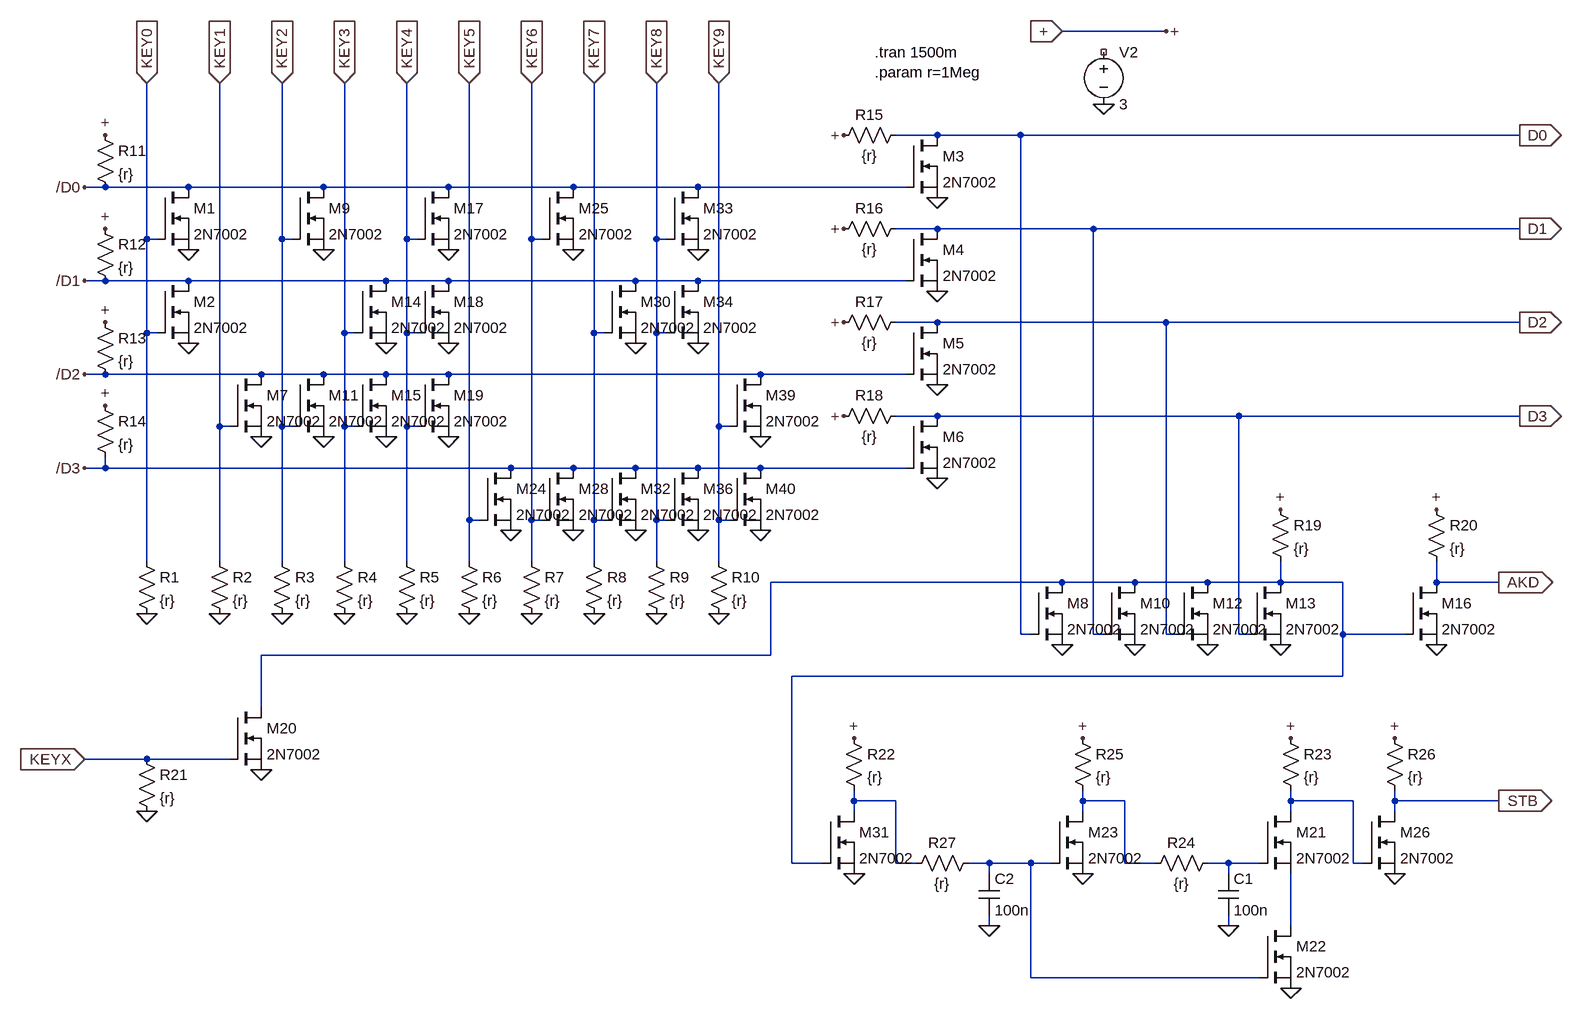
[diagram p0: schematic Keyboard.asc]
Keyboard.asc, the LTspice schematic file:
Version 4
SHEET 1 2060 1584
WIRE 1248 -80 1088 -80
WIRE 896 80 832 80
WIRE 1024 80 896 80
WIRE 1792 80 1024 80
WIRE -384 160 -416 160
WIRE -256 160 -384 160
WIRE -48 160 -256 160
WIRE 144 160 -48 160
WIRE 336 160 144 160
WIRE 528 160 336 160
WIRE 848 160 528 160
WIRE 896 224 832 224
WIRE 1136 224 896 224
WIRE 1792 224 1136 224
WIRE -320 240 -320 0
WIRE -304 240 -320 240
WIRE -112 240 -112 0
WIRE -96 240 -112 240
WIRE 80 240 80 0
WIRE 96 240 80 240
WIRE 272 240 272 0
WIRE 288 240 272 240
WIRE 464 240 464 0
WIRE 480 240 464 240
WIRE -384 304 -416 304
WIRE -256 304 -384 304
WIRE 48 304 -256 304
WIRE 144 304 48 304
WIRE 432 304 144 304
WIRE 528 304 432 304
WIRE 848 304 528 304
WIRE 896 368 832 368
WIRE 1248 368 896 368
WIRE 1792 368 1248 368
WIRE -320 384 -320 240
WIRE -304 384 -320 384
WIRE -16 384 -16 0
WIRE 0 384 -16 384
WIRE 80 384 80 240
WIRE 96 384 80 384
WIRE 368 384 368 0
WIRE 384 384 368 384
WIRE 464 384 464 240
WIRE 480 384 464 384
WIRE -384 448 -416 448
WIRE -144 448 -384 448
WIRE -48 448 -144 448
WIRE 48 448 -48 448
WIRE 144 448 48 448
WIRE 624 448 144 448
WIRE 848 448 624 448
WIRE 896 512 832 512
WIRE 1360 512 896 512
WIRE 1792 512 1360 512
WIRE -208 528 -208 0
WIRE -192 528 -208 528
WIRE -112 528 -112 240
WIRE -96 528 -112 528
WIRE -16 528 -16 384
WIRE 0 528 -16 528
WIRE 80 528 80 384
WIRE 96 528 80 528
WIRE 560 528 560 0
WIRE 576 528 560 528
WIRE -384 592 -384 576
WIRE -384 592 -416 592
WIRE 240 592 -384 592
WIRE 336 592 240 592
WIRE 432 592 336 592
WIRE 528 592 432 592
WIRE 624 592 528 592
WIRE 848 592 624 592
WIRE 176 672 176 0
WIRE 192 672 176 672
WIRE 272 672 272 240
WIRE 288 672 272 672
WIRE 368 672 368 384
WIRE 384 672 368 672
WIRE 464 672 464 384
WIRE 480 672 464 672
WIRE 560 672 560 528
WIRE 576 672 560 672
WIRE -320 736 -320 384
WIRE -208 736 -208 528
WIRE -112 736 -112 528
WIRE -16 736 -16 528
WIRE 80 736 80 528
WIRE 176 736 176 672
WIRE 272 736 272 672
WIRE 368 736 368 672
WIRE 464 736 464 672
WIRE 560 736 560 672
WIRE 1088 768 640 768
WIRE 1200 768 1088 768
WIRE 1312 768 1200 768
WIRE 1424 768 1424 736
WIRE 1424 768 1312 768
WIRE 1520 768 1424 768
WIRE 1664 768 1664 736
WIRE 1760 768 1664 768
WIRE 1024 848 1024 80
WIRE 1040 848 1024 848
WIRE 1136 848 1136 224
WIRE 1152 848 1136 848
WIRE 1248 848 1248 368
WIRE 1264 848 1248 848
WIRE 1360 848 1360 512
WIRE 1376 848 1360 848
WIRE 1520 848 1520 768
WIRE 1616 848 1520 848
WIRE 640 880 640 768
WIRE 640 880 -144 880
WIRE 1520 912 1520 848
WIRE 1520 912 672 912
WIRE -144 960 -144 880
WIRE -320 1040 -416 1040
WIRE -192 1040 -320 1040
WIRE 768 1104 768 1088
WIRE 832 1104 768 1104
WIRE 1120 1104 1120 1088
WIRE 1184 1104 1120 1104
WIRE 1440 1104 1440 1088
WIRE 1536 1104 1440 1104
WIRE 1600 1104 1600 1088
WIRE 1760 1104 1600 1104
WIRE 768 1120 768 1104
WIRE 1120 1120 1120 1104
WIRE 1440 1120 1440 1104
WIRE 1600 1120 1600 1104
WIRE 672 1200 672 912
WIRE 720 1200 672 1200
WIRE 832 1200 832 1104
WIRE 864 1200 832 1200
WIRE 976 1200 944 1200
WIRE 1040 1200 976 1200
WIRE 1072 1200 1040 1200
WIRE 1184 1200 1184 1104
WIRE 1232 1200 1184 1200
WIRE 1344 1200 1312 1200
WIRE 1392 1200 1344 1200
WIRE 1536 1200 1536 1104
WIRE 1552 1200 1536 1200
WIRE 976 1216 976 1200
WIRE 1344 1216 1344 1200
WIRE 976 1296 976 1280
WIRE 1344 1296 1344 1280
WIRE 1440 1296 1440 1216
WIRE 1040 1376 1040 1200
WIRE 1392 1376 1040 1376
FLAG -256 256 0
FLAG -320 0 KEY0
IOPIN -320 0 In
FLAG -256 400 0
FLAG -208 0 KEY1
IOPIN -208 0 In
FLAG -112 0 KEY2
IOPIN -112 0 In
FLAG -16 0 KEY3
IOPIN -16 0 In
FLAG 80 0 KEY4
IOPIN 80 0 In
FLAG 176 0 KEY5
IOPIN 176 0 In
FLAG 272 0 KEY6
IOPIN 272 0 In
FLAG 368 0 KEY7
IOPIN 368 0 In
FLAG 464 0 KEY8
IOPIN 464 0 In
FLAG 560 0 KEY9
IOPIN 560 0 In
FLAG -416 160 /D0
FLAG -416 304 /D1
FLAG -416 448 /D2
FLAG -416 592 /D3
FLAG -144 544 0
FLAG -48 256 0
FLAG -48 544 0
FLAG 48 400 0
FLAG 48 544 0
FLAG 144 256 0
FLAG 144 400 0
FLAG 144 544 0
FLAG 240 688 0
FLAG 336 256 0
FLAG 336 688 0
FLAG 432 400 0
FLAG 432 688 0
FLAG 528 256 0
FLAG 528 400 0
FLAG 528 688 0
FLAG 624 544 0
FLAG 624 688 0
FLAG -320 816 0
FLAG -208 816 0
FLAG -112 816 0
FLAG -16 816 0
FLAG 80 816 0
FLAG 176 816 0
FLAG 272 816 0
FLAG 368 816 0
FLAG 464 816 0
FLAG 560 816 0
FLAG -384 496 +
FLAG -384 368 +
FLAG -384 224 +
FLAG -384 80 +
FLAG 896 608 0
FLAG 896 464 0
FLAG 896 320 0
FLAG 896 176 0
FLAG 752 512 +
FLAG 752 368 +
FLAG 752 224 +
FLAG 752 80 +
FLAG 1792 80 D0
IOPIN 1792 80 Out
FLAG 1792 224 D1
IOPIN 1792 224 Out
FLAG 1792 368 D2
IOPIN 1792 368 Out
FLAG 1792 512 D3
IOPIN 1792 512 Out
FLAG 1088 864 0
FLAG 1200 864 0
FLAG 1312 864 0
FLAG 1424 864 0
FLAG 1424 656 +
FLAG 1664 864 0
FLAG 1664 656 +
FLAG 1760 768 AKD
IOPIN 1760 768 Out
FLAG -416 1040 KEYX
IOPIN -416 1040 In
FLAG -144 1056 0
FLAG -320 1120 0
FLAG 1248 -80 +
FLAG 1088 -80 +
IOPIN 1088 -80 In
FLAG 1760 1104 STB
IOPIN 1760 1104 Out
FLAG 1440 1008 +
FLAG 1344 1296 0
FLAG 1440 1392 0
FLAG 1120 1216 0
FLAG 1120 1008 +
FLAG 1600 1216 0
FLAG 1600 1008 +
FLAG 768 1216 0
FLAG 768 1008 +
FLAG 1152 32 0
FLAG 976 1296 0
SYMBOL nmos -304 160 R0
SYMATTR InstName M1
SYMATTR Value 2N7002
SYMBOL nmos -304 304 R0
SYMATTR InstName M2
SYMATTR Value 2N7002
SYMBOL nmos -192 448 R0
SYMATTR InstName M7
SYMATTR Value 2N7002
SYMBOL nmos -96 160 R0
SYMATTR InstName M9
SYMATTR Value 2N7002
SYMBOL nmos -96 448 R0
SYMATTR InstName M11
SYMATTR Value 2N7002
SYMBOL nmos 0 304 R0
SYMATTR InstName M14
SYMATTR Value 2N7002
SYMBOL nmos 0 448 R0
SYMATTR InstName M15
SYMATTR Value 2N7002
SYMBOL nmos 96 160 R0
SYMATTR InstName M17
SYMATTR Value 2N7002
SYMBOL nmos 96 304 R0
SYMATTR InstName M18
SYMATTR Value 2N7002
SYMBOL nmos 96 448 R0
SYMATTR InstName M19
SYMATTR Value 2N7002
SYMBOL nmos 192 592 R0
SYMATTR InstName M24
SYMATTR Value 2N7002
SYMBOL nmos 288 160 R0
SYMATTR InstName M25
SYMATTR Value 2N7002
SYMBOL nmos 288 592 R0
SYMATTR InstName M28
SYMATTR Value 2N7002
SYMBOL nmos 384 304 R0
SYMATTR InstName M30
SYMATTR Value 2N7002
SYMBOL nmos 384 592 R0
SYMATTR InstName M32
SYMATTR Value 2N7002
SYMBOL nmos 480 160 R0
SYMATTR InstName M33
SYMATTR Value 2N7002
SYMBOL nmos 480 304 R0
SYMATTR InstName M34
SYMATTR Value 2N7002
SYMBOL nmos 480 592 R0
SYMATTR InstName M36
SYMATTR Value 2N7002
SYMBOL nmos 576 448 R0
SYMATTR InstName M39
SYMATTR Value 2N7002
SYMBOL nmos 576 592 R0
SYMATTR InstName M40
SYMATTR Value 2N7002
SYMBOL res -336 720 R0
SYMATTR InstName R1
SYMATTR Value {r}
SYMBOL res -224 720 R0
SYMATTR InstName R2
SYMATTR Value {r}
SYMBOL res -128 720 R0
SYMATTR InstName R3
SYMATTR Value {r}
SYMBOL res -32 720 R0
SYMATTR InstName R4
SYMATTR Value {r}
SYMBOL res 64 720 R0
SYMATTR InstName R5
SYMATTR Value {r}
SYMBOL res 160 720 R0
SYMATTR InstName R6
SYMATTR Value {r}
SYMBOL res 256 720 R0
SYMATTR InstName R7
SYMATTR Value {r}
SYMBOL res 352 720 R0
SYMATTR InstName R8
SYMATTR Value {r}
SYMBOL res 448 720 R0
SYMATTR InstName R9
SYMATTR Value {r}
SYMBOL res 544 720 R0
SYMATTR InstName R10
SYMATTR Value {r}
SYMBOL res -400 64 R0
SYMATTR InstName R11
SYMATTR Value {r}
SYMBOL res -400 208 R0
SYMATTR InstName R12
SYMATTR Value {r}
SYMBOL res -400 352 R0
SYMATTR InstName R13
SYMATTR Value {r}
SYMBOL res -400 480 R0
SYMATTR InstName R14
SYMATTR Value {r}
SYMBOL nmos 848 80 R0
SYMATTR InstName M3
SYMATTR Value 2N7002
SYMBOL nmos 848 224 R0
SYMATTR InstName M4
SYMATTR Value 2N7002
SYMBOL nmos 848 368 R0
SYMATTR InstName M5
SYMATTR Value 2N7002
SYMBOL nmos 848 512 R0
SYMATTR InstName M6
SYMATTR Value 2N7002
SYMBOL res 848 64 R90
WINDOW 0 0 56 VBottom 2
WINDOW 3 32 56 VTop 2
SYMATTR InstName R15
SYMATTR Value {r}
SYMBOL res 848 208 R90
WINDOW 0 0 56 VBottom 2
WINDOW 3 32 56 VTop 2
SYMATTR InstName R16
SYMATTR Value {r}
SYMBOL res 848 352 R90
WINDOW 0 0 56 VBottom 2
WINDOW 3 32 56 VTop 2
SYMATTR InstName R17
SYMATTR Value {r}
SYMBOL res 848 496 R90
WINDOW 0 0 56 VBottom 2
WINDOW 3 32 56 VTop 2
SYMATTR InstName R18
SYMATTR Value {r}
SYMBOL nmos 1040 768 R0
SYMATTR InstName M8
SYMATTR Value 2N7002
SYMBOL nmos 1152 768 R0
SYMATTR InstName M10
SYMATTR Value 2N7002
SYMBOL nmos 1264 768 R0
SYMATTR InstName M12
SYMATTR Value 2N7002
SYMBOL nmos 1376 768 R0
SYMATTR InstName M13
SYMATTR Value 2N7002
SYMBOL res 1408 640 R0
SYMATTR InstName R19
SYMATTR Value {r}
SYMBOL nmos 1616 768 R0
SYMATTR InstName M16
SYMATTR Value 2N7002
SYMBOL res 1648 640 R0
SYMATTR InstName R20
SYMATTR Value {r}
SYMBOL nmos -192 960 R0
SYMATTR InstName M20
SYMATTR Value 2N7002
SYMBOL res -336 1024 R0
SYMATTR InstName R21
SYMATTR Value {r}
SYMBOL nmos 1392 1120 R0
SYMATTR InstName M21
SYMATTR Value 2N7002
SYMBOL res 1424 992 R0
SYMATTR InstName R23
SYMATTR Value {r}
SYMBOL cap 1328 1216 R0
SYMATTR InstName C1
SYMATTR Value 100n
SYMBOL nmos 1392 1296 R0
SYMATTR InstName M22
SYMATTR Value 2N7002
SYMBOL nmos 1072 1120 R0
SYMATTR InstName M23
SYMATTR Value 2N7002
SYMBOL res 1104 992 R0
SYMATTR InstName R25
SYMATTR Value {r}
SYMBOL nmos 1552 1120 R0
SYMATTR InstName M26
SYMATTR Value 2N7002
SYMBOL res 1584 992 R0
SYMATTR InstName R26
SYMATTR Value {r}
SYMBOL nmos 720 1120 R0
SYMATTR InstName M31
SYMATTR Value 2N7002
SYMBOL res 752 992 R0
SYMATTR InstName R22
SYMATTR Value {r}
SYMBOL voltage 1152 -64 R0
SYMATTR InstName V2
SYMATTR Value 3
SYMATTR SpiceLine Rser=100
SYMBOL res 1328 1184 R90
WINDOW 0 0 56 VBottom 2
WINDOW 3 32 56 VTop 2
SYMATTR InstName R24
SYMATTR Value {r}
SYMBOL res 960 1184 R90
WINDOW 0 0 56 VBottom 2
WINDOW 3 32 56 VTop 2
SYMATTR InstName R27
SYMATTR Value {r}
SYMBOL cap 960 1216 R0
SYMATTR InstName C2
SYMATTR Value 100n
TEXT 800 -48 Left 2 !.tran 1500m\n.param r=1Meg

The netlist it stands for:
* Keyboard.asc
M1 /D0 KEY0 0 0 2N7002
M2 /D1 KEY0 0 0 2N7002
M7 /D2 KEY1 0 0 2N7002
M9 /D0 KEY2 0 0 2N7002
M11 /D2 KEY2 0 0 2N7002
M14 /D1 KEY3 0 0 2N7002
M15 /D2 KEY3 0 0 2N7002
M17 /D0 KEY4 0 0 2N7002
M18 /D1 KEY4 0 0 2N7002
M19 /D2 KEY4 0 0 2N7002
M24 /D3 KEY5 0 0 2N7002
M25 /D0 KEY6 0 0 2N7002
M28 /D3 KEY6 0 0 2N7002
M30 /D1 KEY7 0 0 2N7002
M32 /D3 KEY7 0 0 2N7002
M33 /D0 KEY8 0 0 2N7002
M34 /D1 KEY8 0 0 2N7002
M36 /D3 KEY8 0 0 2N7002
M39 /D2 KEY9 0 0 2N7002
M40 /D3 KEY9 0 0 2N7002
R1 KEY0 0 {r}
R2 KEY1 0 {r}
R3 KEY2 0 {r}
R4 KEY3 0 {r}
R5 KEY4 0 {r}
R6 KEY5 0 {r}
R7 KEY6 0 {r}
R8 KEY7 0 {r}
R9 KEY8 0 {r}
R10 KEY9 0 {r}
R11 + /D0 {r}
R12 + /D1 {r}
R13 + /D2 {r}
R14 + /D3 {r}
M3 D0 /D0 0 0 2N7002
M4 D1 /D1 0 0 2N7002
M5 D2 /D2 0 0 2N7002
M6 D3 /D3 0 0 2N7002
R15 D0 + {r}
R16 D1 + {r}
R17 D2 + {r}
R18 D3 + {r}
M8 N001 D0 0 0 2N7002
M10 N001 D1 0 0 2N7002
M12 N001 D2 0 0 2N7002
M13 N001 D3 0 0 2N7002
R19 + N001 {r}
M16 AKD N001 0 0 2N7002
R20 + AKD {r}
M20 N001 KEYX 0 0 2N7002
R21 KEYX 0 {r}
M21 N004 N006 N007 N007 2N7002
R23 + N004 {r}
C1 N006 0 100n
M22 N007 N005 0 0 2N7002
M23 N003 N005 0 0 2N7002
R25 + N003 {r}
M26 STB N004 0 0 2N7002
R26 + STB {r}
M31 N002 N001 0 0 2N7002
R22 + N002 {r}
V2 NC_01 0 3 Rser=100
R24 N006 N003 {r}
R27 N005 N002 {r}
C2 N005 0 100n
.model NMOS NMOS
.model PMOS PMOS
.lib standard.mos
.tran 1500m
.param r=1Meg
.backanno
.end